# EAGLE design EEG board (EAGLE 7.5.0)
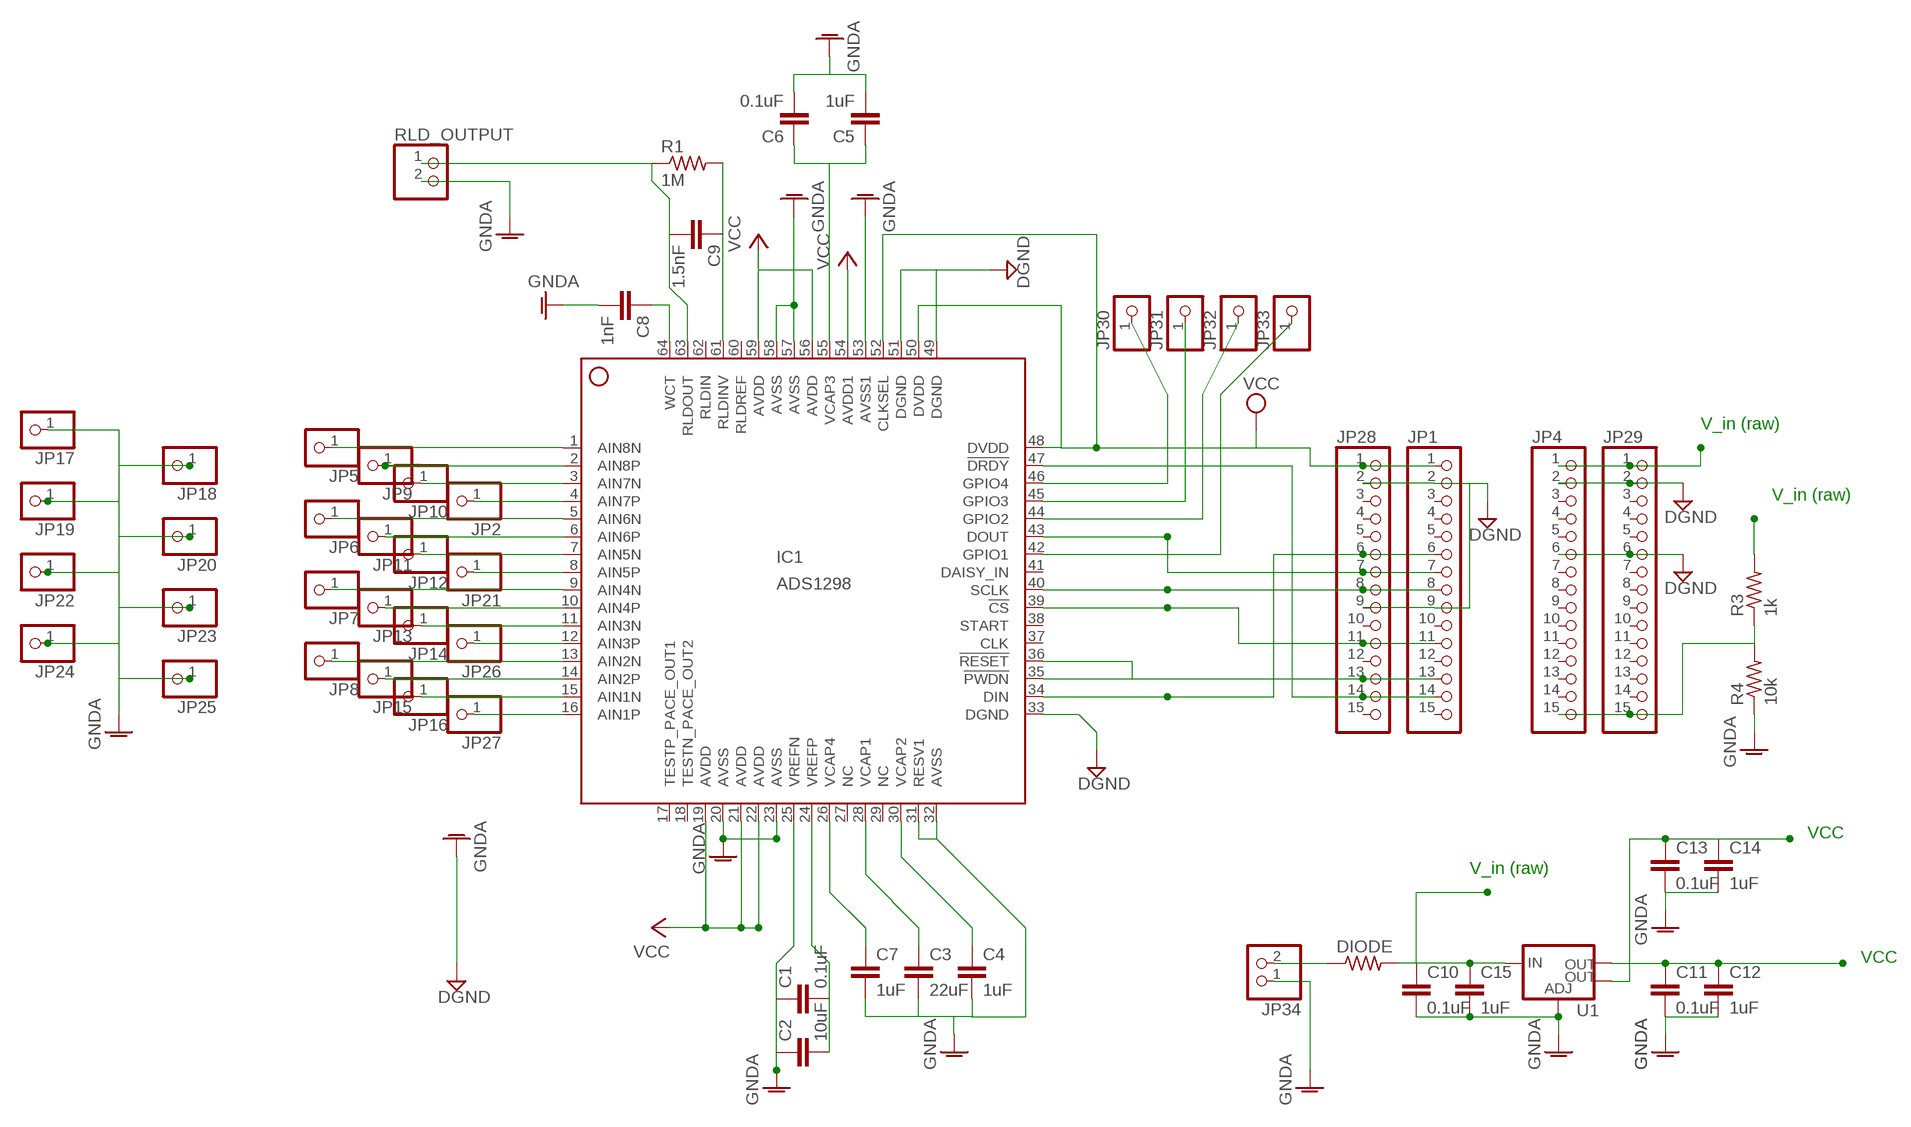
[diagram p0: schematic, sheet 1]

## Parts
C1  0.1uF  C-EUC0805  [C0805]
C2  10uF  C-EUC0805  [C0805]
C3  22uF  C-EUC0805  [C0805]
C4  1uF  C-EUC0805  [C0805]
C5  1uF  C-EUC0805  [C0805]
C6  0.1uF  C-EUC0805  [C0805]
C7  1uF  C-EUC0805  [C0805]
C8  1nF  C-EUC0805  [C0805]
C9  1.5nF  C-EUC0805  [C0805]
C10  0.1uF  C-EUC0805  [C0805]
C11  0.1uF  C-EUC0805  [C0805]
C12  1uF  C-EUC0805  [C0805]
C13  0.1uF  C-EUC0805  [C0805]
C14  1uF  C-EUC0805  [C0805]
C15  1uF  C-EUC0805  [C0805]
DIODE  R-US_R0805  [R0805]
IC1  ADS1298  [HTQFP-64-PAP]
JP1  PINHD-1X15  [1X15]
JP2  PINHD-1X1  [1X01]
JP4  PINHD-1X15  [1X15]
JP5  PINHD-1X1  [1X01]
JP6  PINHD-1X1  [1X01]
JP7  PINHD-1X1  [1X01]
JP8  PINHD-1X1  [1X01]
JP9  PINHD-1X1  [1X01]
JP10  PINHD-1X1  [1X01]
JP11  PINHD-1X1  [1X01]
JP12  PINHD-1X1  [1X01]
JP13  PINHD-1X1  [1X01]
JP14  PINHD-1X1  [1X01]
JP15  PINHD-1X1  [1X01]
JP16  PINHD-1X1  [1X01]
JP17  PINHD-1X1  [1X01]
JP18  PINHD-1X1  [1X01]
JP19  PINHD-1X1  [1X01]
JP20  PINHD-1X1  [1X01]
JP21  PINHD-1X1  [1X01]
JP22  PINHD-1X1  [1X01]
JP23  PINHD-1X1  [1X01]
JP24  PINHD-1X1  [1X01]
JP25  PINHD-1X1  [1X01]
JP26  PINHD-1X1  [1X01]
JP27  PINHD-1X1  [1X01]
JP28  PINHD-1X15  [1X15]
JP29  PINHD-1X15  [1X15]
JP30  PINHD-1X1  [1X01]
JP31  PINHD-1X1  [1X01]
JP32  PINHD-1X1  [1X01]
JP33  PINHD-1X1  [1X01]
JP34  PINHD-1X2  [1X02]
R1  1M  R-US_R0805  [R0805]
R3  1k  R-US_R0805  [R0805]
R4  10k  R-US_R0805  [R0805]
RLD_OUTPUT  PINHD-1X2/90  [1X02/90]
U1  V_REG_LM1117SOT223  [SOT223]

## Nets
9V: DIODE.1 JP34.2
AVDD: C11.1 C12.1 IC1.54(AVDD1) U1.2(OUT) ; supply symbol labelled VCC
AVDD1: C13.1 C14.1 IC1.19(AVDD) IC1.21(AVDD) IC1.22(AVDD) IC1.56(AVDD) IC1.59(AVDD) U1.4(OUT) ; supply symbol labelled VCC
AVSS: C1.1 C2.1 C3.2 C4.2 C5.2 C6.2 C7.2 C8.2 C10.2 C11.2 C12.2 C13.2 C14.2 C15.2 IC1.20(AVSS) IC1.23(AVSS) IC1.25(VREFN) IC1.31(RESV1) IC1.32(AVSS) IC1.53(AVSS1) IC1.57(AVSS) IC1.58(AVSS) JP4.2 JP17.1 JP18.1 JP19.1 JP20.1 JP22.1 JP23.1 JP24.1 JP25.1 JP29.2 JP34.1 R4.1 RLD_OUTPUT.2 U1.1(ADJ) ; supply symbol labelled GNDA, DGND
CS: IC1.39(!CS) JP1.11 JP28.11
DGND: IC1.33(DGND) IC1.49(DGND) IC1.51(DGND) JP1.2 JP1.9 JP4.6 JP28.2 JP28.9 JP29.6
DIN: IC1.34(DIN) JP1.6 JP28.6
DOUT: IC1.43(DOUT) JP1.7 JP28.7
DRDY: IC1.47(!DRDY) JP1.14 JP28.14
DVDD: IC1.48(DVDD) IC1.50(DVDD) IC1.52(CLKSEL) JP1.1 JP28.1 ; supply symbol labelled VCC
N$1: IC1.1(AIN8N) JP5.1
N$2: IC1.2(AIN8P) JP9.1
N$3: IC1.3(AIN7N) JP10.1
N$4: IC1.4(AIN7P) JP2.1
N$5: IC1.5(AIN6N) JP6.1
N$6: IC1.6(AIN6P) JP11.1
N$7: IC1.7(AIN5N) JP12.1
N$8: IC1.8(AIN5P) JP21.1
N$9: IC1.9(AIN4N) JP7.1
N$10: IC1.10(AIN4P) JP13.1
N$11: IC1.11(AIN3N) JP14.1
N$12: IC1.12(AIN3P) JP26.1
N$13: IC1.13(AIN2N) JP8.1
N$14: IC1.14(AIN2P) JP15.1
N$15: IC1.15(AIN1N) JP16.1
N$16: IC1.16(AIN1P) JP27.1
N$18: C1.2 C2.2 IC1.24(VREFP)
N$19: C3.1 IC1.28(VCAP1)
N$20: C4.1 IC1.30(VCAP2)
N$21: C5.1 C6.1 IC1.55(VCAP3)
N$22: C8.1 IC1.64(WCT)
N$23: C7.1 IC1.26(VCAP4)
N$24: C9.1 IC1.61(RLDINV) R1.2
N$25: JP4.15 JP29.15 R3.1 R4.2
N$26: C9.2 IC1.63(RLDOUT) R1.1 RLD_OUTPUT.1
N$27: IC1.45(GPIO3) JP31.1
N$28: IC1.44(GPIO2) JP32.1
N$29: IC1.42(GPIO1) JP33.1
N$30: IC1.46(GPIO4) JP30.1
PDWN/RESET: IC1.35(!PWDN) IC1.36(!RESET) JP1.13 JP28.13
SCLK: IC1.40(SCLK) JP1.8 JP28.8
VIN: C10.1 C15.1 DIODE.2 JP4.1 JP29.1 R3.2 U1.3(IN)
Unconnected: IC1.17(TESTP_PACE_OUT1) IC1.18(TESTN_PACE_OUT2) IC1.27(NC) IC1.29(NC) IC1.37(CLK) IC1.38(START) IC1.41(DAISY_IN) IC1.60(RLDREF) IC1.62(RLDIN) JP1.3 JP1.4 JP1.5 JP1.10 JP1.12 JP1.15 JP4.3 JP4.4 JP4.5 JP4.7 JP4.8 JP4.9 JP4.10 JP4.11 JP4.12 JP4.13 JP4.14 JP28.3 JP28.4 JP28.5 JP28.10 JP28.12 JP28.15 JP29.3 JP29.4 JP29.5 JP29.7 JP29.8 JP29.9 JP29.10 JP29.11 JP29.12 JP29.13 JP29.14

## Notes on the sheet
- V_in (raw)
- V_in (raw)
- VCC
- V_in (raw)
- VCC

## Library data of the parts
C1-C15 = rcl - matt:C-EU: CAPACITOR, European symbol
DIODE R1 R3 R4 = rcl - matt:R-US_: RESISTOR, American symbol
IC1 = ADS1298:ADS1298: Quad/Octal, Simultaneous Sampling, 24-Bit Analog-to-Digital Converters ADS1294 / ADS1298 Source: http://focus.ti.com/lit/ds/symlink/ads1294.pdf; AVAILABILITY: Unavailable; DESCRIPTION: 8-Channel 24-Bit Analog-To-Digital Converter With Integrated ECG Front End; MF: Texas Instruments; MP: ADS1298; PACKAGE: None; PRICE: None
JP1 JP4 JP28 JP29 = pinhead:PINHD-1X15: PIN HEADER
JP2 JP5-JP27 JP30-JP33 = pinhead:PINHD-1X1: PIN HEADER
JP34 RLD_OUTPUT = pinhead:PINHD-1X2: PIN HEADER
U1 = SparkFun-IC-Power:V_REG_LM1117: Voltage Regulator LM1117 Standard adjustable voltage regulator but in SMD form. Spark Fun Electronics SKU : COM-00595; PROD_ID: VREG-08170

## Board
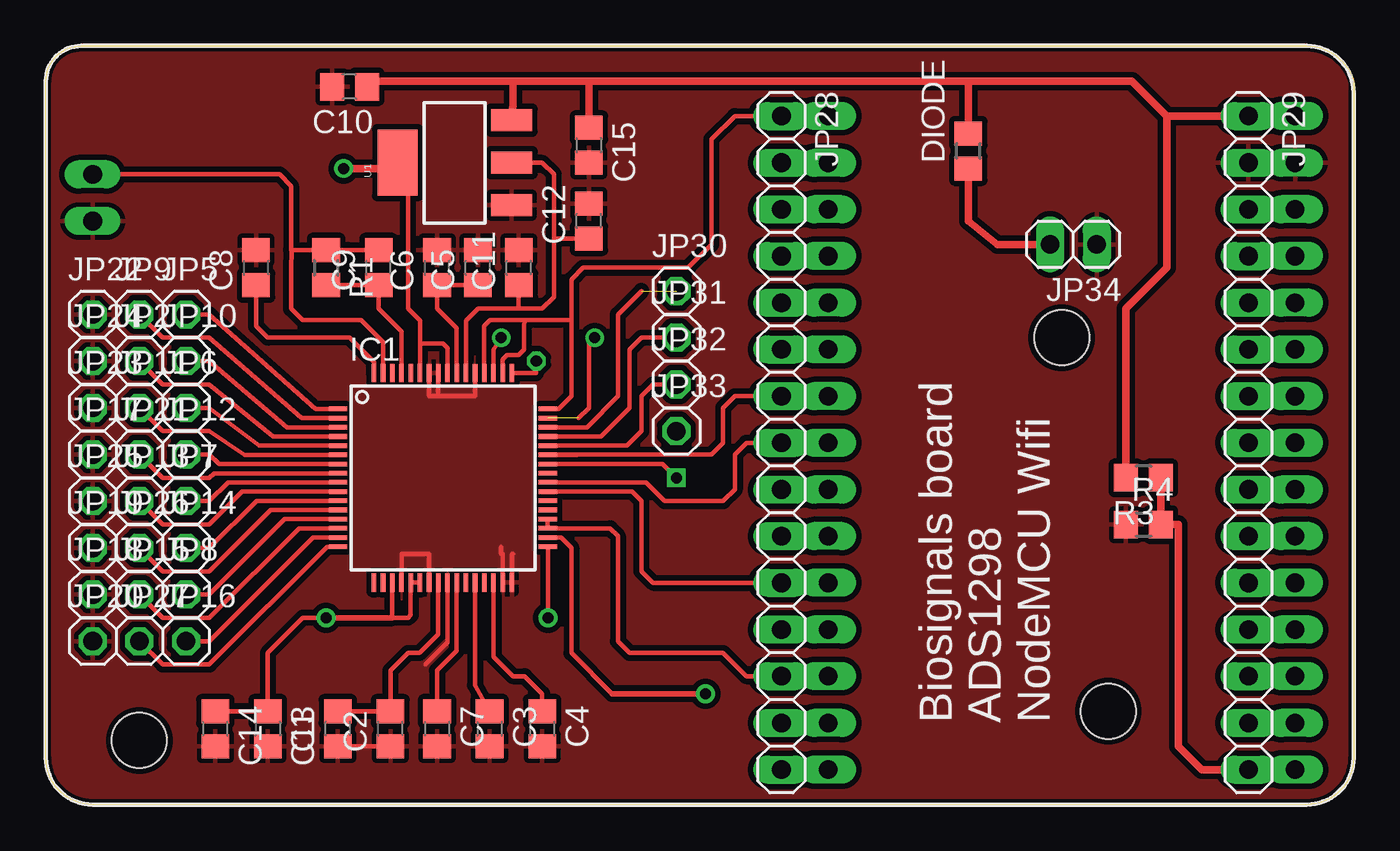
[diagram p1: board, top side]
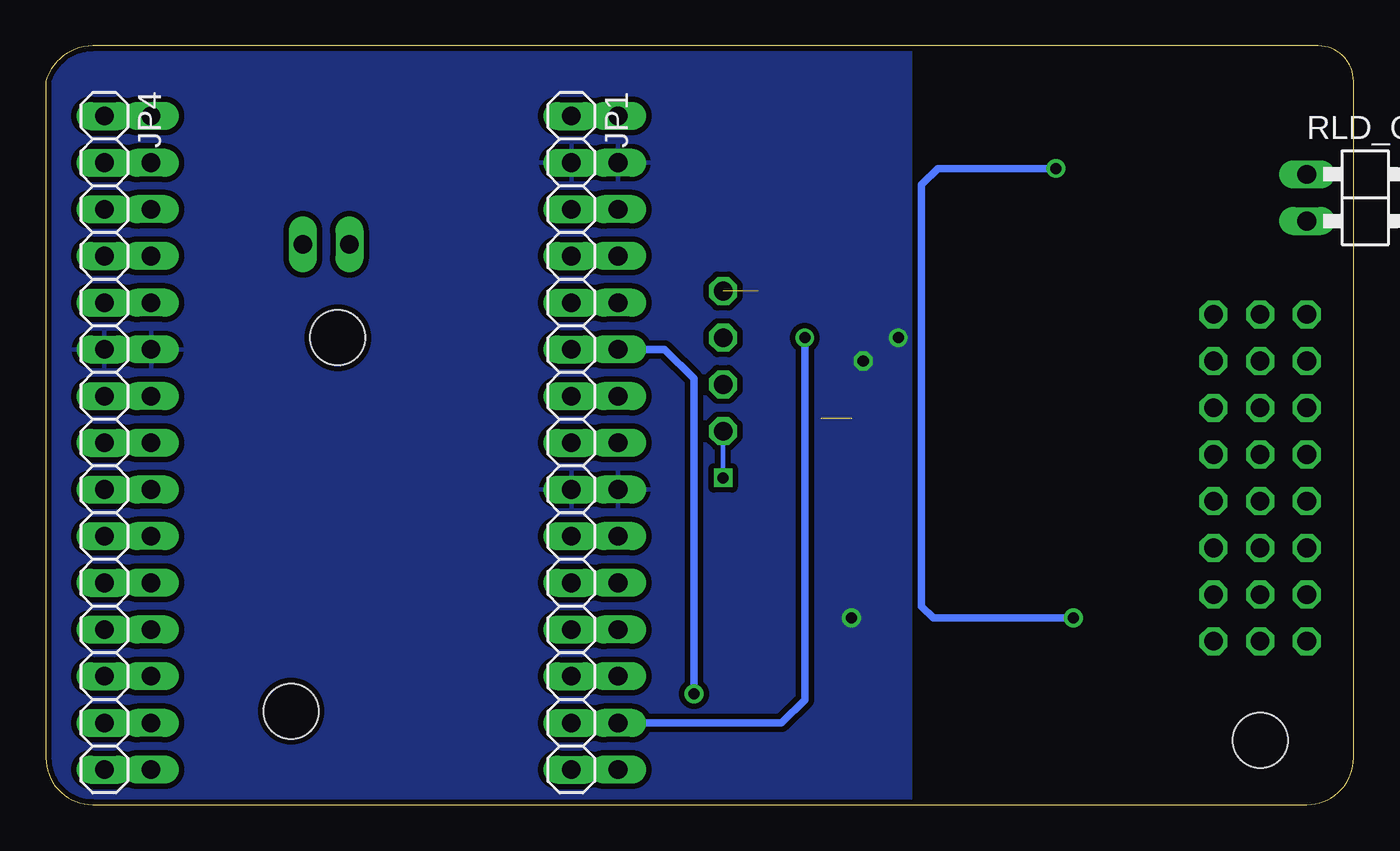
[diagram p2: board, bottom side, seen from below]

Size 71.12 x 41.27 mm. Coordinates in mm from the lower left corner, seen from the top.
Outline: 1.91,41.27 68.58,41.27 arc-74 71.12,39.37 71.12,2.54 arc-90 68.58,0 2.54,0 arc-90 0,2.54 0,39.37 arc-90 1.91,41.27
Copper layers (1*16): Top 0.035mm / dielectric 1.5mm / Bottom 0.035mm
Design rules "default *": minimum track width 8mil, minimum drill 0.3mm, track to track 8mil, track to pad 8mil, pad to pad 8mil, via to via 8mil, smd to smd 8mil, copper to edge 12mil, drill to drill 10mil, minimum pad ring 10mil, minimum via ring 8mil, stop-mask expansion 4mil, vias tented up to drill 30mil, thermal gap 10mil
Holes 3 mm at 5.08,3.49 57.78,5.08 55.24,25.4

### Footprints (pad centres in the part's own frame; a part is rotated, then mirrored left to right if it is on the bottom)
C0805 = smd 1.3 x 1.5: 1 -0.95,0; 2 0.95,0
R0805 = smd 1.3 x 1.5: 1 -0.95,0; 2 0.95,0
HTQFP-64-PAP = smd 1 x 0.25: 1 -5.7,3.75; 2 -5.7,3.25; 3 -5.7,2.75; 4 -5.7,2.25; 5 -5.7,1.75; 6 -5.7,1.25; 7 -5.7,0.75; 8 -5.7,0.25; 9 -5.7,-0.25; 10 -5.7,-0.75; 11 -5.7,-1.25; 12 -5.7,-1.75; 13 -5.7,-2.25; 14 -5.7,-2.75; 15 -5.7,-3.25; 16 -5.7,-3.75; 33 5.7,-3.75; 34 5.7,-3.25; 35 5.7,-2.75; 36 5.7,-2.25; 37 5.7,-1.75; 38 5.7,-1.25; 39 5.7,-0.75; 40 5.7,-0.25; 41 5.7,0.25; 42 5.7,0.75; 43 5.7,1.25; 44 5.7,1.75; 45 5.7,2.25; 46 5.7,2.75; 47 5.7,3.25; 48 5.7,3.75 | smd 0.25 x 1: 17 -3.75,-5.7; 18 -3.25,-5.7; 19 -2.75,-5.7; 20 -2.25,-5.7; 21 -1.75,-5.7; 22 -1.25,-5.7; 23 -0.75,-5.7; 24 -0.25,-5.7; 25 0.25,-5.7; 26 0.75,-5.7; 27 1.25,-5.7; 28 1.75,-5.7; 29 2.25,-5.7; 30 2.75,-5.7; 31 3.25,-5.7; 32 3.75,-5.7; 49 3.75,5.7; 50 3.25,5.7; 51 2.75,5.7; 52 2.25,5.7; 53 1.75,5.7; 54 1.25,5.7; 55 0.75,5.7; 56 0.25,5.7; 57 -0.25,5.7; 58 -0.75,5.7; 59 -1.25,5.7; 60 -1.75,5.7; 61 -2.25,5.7; 62 -2.75,5.7; 63 -3.25,5.7; 64 -3.75,5.7
1X15 = drill 1.016 long: 1 -17.78,0; 2 -15.24,0; 3 -12.7,0; 4 -10.16,0; 5 -7.62,0; 6 -5.08,0; 7 -2.54,0; 8 0,0; 9 2.54,0; 10 5.08,0; 11 7.62,0; 12 10.16,0; 13 12.7,0; 14 15.24,0; 15 17.78,0
1X01 = drill 1.016 octagon: 1 0,0
1X02 = drill 1.016 long: 1 -1.27,0; 2 1.27,0
1X02/90 = drill 1.016 long: 1 -1.27,-3.81; 2 1.27,-3.81
SOT223 = smd 1.219 x 2.235: 1 -2.311,-3.099; 2 0,-3.099; 3 2.311,-3.099 | smd 3.6 x 2.2: 4 0,3.099

### Placement (x,y rotation side)
C1  15.88,4.13 90 top
C2  18.73,4.13 90 top
C3  24.13,4.13 270 top
C4  26.99,4.13 270 top
C5  23.5,29.21 90 top
C6  21.27,29.21 90 top
C7  21.27,4.13 270 top
C8  11.43,29.21 90 top
C9  18.1,29.21 90 top
C10  16.51,39.05 180 top
C11  25.72,29.21 90 top
C12  29.53,31.75 90 top
C13  12.06,4.13 270 top
C14  9.21,4.13 270 top
C15  29.53,35.88 270 top
DIODE  50.16,35.56 90 top
IC1  21.59,17.78 0 top
JP1  42.55,19.68 270 bottom
JP2  5.08,24.13 0 top
JP4  67.94,19.68 270 bottom
JP5  7.62,26.67 0 top
JP6  7.62,21.59 0 top
JP7  7.62,16.51 0 top
JP8  7.62,11.43 0 top
JP9  5.08,26.67 0 top
JP10  7.62,24.13 0 top
JP11  5.08,21.59 0 top
JP12  7.62,19.05 0 top
JP13  5.08,16.51 0 top
JP14  7.62,13.97 0 top
JP15  5.08,11.43 0 top
JP16  7.62,8.89 0 top
JP17  2.54,19.05 0 top
JP18  2.54,11.43 0 top
JP19  2.54,13.97 0 top
JP20  2.54,8.89 0 top
JP21  5.08,19.05 0 top
JP22  2.54,26.67 0 top
JP23  2.54,21.59 0 top
JP24  2.54,24.13 0 top
JP25  2.54,16.51 0 top
JP26  5.08,13.97 0 top
JP27  5.08,8.89 0 top
JP28  40.01,19.68 270 top
JP29  65.41,19.68 270 top
JP30  34.29,27.94 0 top
JP31  34.29,25.4 0 top
JP32  34.29,22.86 0 top
JP33  34.29,20.32 0 top
JP34  55.88,30.48 180 top
R1  15.24,29.21 270 top
R3  59.69,17.78 180 top
R4  59.69,15.24 0 top
RLD_OUTPUT  -1.27,33.02 270 bottom
U1  22.23,34.92 90 top

### Tracks (layer width: path | path; a pad name or v marks a point on that pad's centre or on a via)
9V
  Top 0.406: DIODE.1 50.16,31.75 51.76,30.48 JP34.2
AVDD
  Top 0.254: IC1.54 22.84,26.33 23.5,26.99 25.72,26.99 | 25.72,26.99 26.99,26.99 27.62,27.62 27.62,30.8 | 27.62,30.8 27.62,34.29 26.99,34.92 U1.2 | C11.1 25.72,26.99 | C12.1 27.62,30.8
AVDD1  (via drill 0.6 pad 1.02)
  Top 0.254: IC1.19 18.84,10.16 19.68,10.16 19.84,10.31 IC1.21 IC1.22 | 19.37,34.61 19.37,33.9 19.13,33.66 U1.4 20,34.05 20,33.97 19.68,33.66 19.68,26.99 20.34,26.33 20.34,25.08 | v15.24,10.16 13.97,10.16 12.06,8.26 C13.1 C14.1 | IC1.56 21.84,24.83 21.59,25.08 20.34,25.08 | IC1.59 20.34,25.08
  Top 0.305: v15.24,10.16 18.84,10.16
  Top 0.406: v16.19,34.61 19.37,34.61
  Bottom 0.254: 16.23,34.65 v16.19,34.61
  Bottom 0.406: v15.24,10.16 22.86,10.16 23.5,10.79 23.5,33.73 22.62,34.61 v16.19,34.61
AVSS
  Top 0.254: 21.34,22.86 IC1.57 21.34,22.23 | IC1.32 25.34,13.65 25.4,13.65 | IC1.31 24.84,13.65 24.77,13.65 24.77,14.03 | IC1.58 20.84,22.23 21.34,22.23 | IC1.53 23.34,22.23 21.34,22.23 | IC1.23 20.84,13.65 19.34,13.65 IC1.20 | C2.1 C1.1 | IC1.25 21.84,8.82 20.64,7.62
  pour Top (isolate 0.305): 68.58,41.27 1.91,41.27 arc90 0,39.37 0,2.54 arc90 2.54,0 68.58,0 arc90 71.12,2.54 71.12,39.37 arc74
CS
  Top 0.254: IC1.39 31.86,17.03 32.38,16.51 32.38,12.7 33.02,12.06 JP28.11 | 41.91,12.06 JP1.11
  Top 0.406: JP28.11 41.91,12.06
DGND  (via drill 0.6 pad 1.02)
  Top 0.254: IC1.33 arc-90 27.3,14.02 v27.3,10.16 | IC1.51 24.34,24.77 v24.77,25.4 | IC1.49 26.66,23.48 v26.67,24.13
  pour Bottom (isolate 0.305): 68.58,0 24.13,0 24.13,41.27 68.58,41.27 arc-74 71.12,39.37 71.12,2.54 arc-90
DIN  (via drill 0.6 pad 1.02)
  Top 0.254: IC1.34 28.02,14.53 28.57,13.97 28.57,8.26 30.8,6.03
  Top 0.305: v35.88,6.03 30.8,6.03
  Bottom 0.406: v35.88,6.03 35.88,23.18 37.47,24.77 JP28.6 JP1.6
DOUT
  Top 0.254: 36.2,19.05 36.83,19.68 36.83,21.59 37.47,22.23 JP28.7 | 36.2,19.05 28.87,19.03 IC1.43 | IC1.43 | IC1.43 27.29,19.05 36.2,19.05 | 41.91,22.23 JP1.7
  Top 0.406: JP28.7 41.91,22.23
DRDY  (via drill 0.6)  (1 unrouted)
  Top 0.254: 28.97,21.03 29.53,21.59 29.53,25.08 v29.84,25.4
  Bottom 0.406: v29.84,25.4 29.84,5.71 31.11,4.45 JP28.14 JP1.14
DVDD
  Top 0.254: IC1.48 27.88,21.53 28.57,22.23 28.57,26.35 | 28.57,26.35 28.57,28.57 29.21,29.21 34.92,29.21 36.2,30.48 36.2,36.2 37.47,37.47 JP28.1 | IC1.50 24.84,24.2 25.08,24.45 25.7,24.45 26.02,24.77 26.02,26.02 26.04,26.35 | 28.57,26.35 26.04,26.35 | IC1.52 23.84,26.04 24.16,26.35 26.04,26.35
  Top 0.406: JP28.1 JP1.1
N$1
  Top 0.254: IC1.1 14.66,21.53 8.89,26.67 JP5.1
N$2
  Top 0.254: IC1.2 13.89,21.03 8.89,25.4 6.35,25.4 JP9.1
N$3
  Top 0.254: IC1.3 13.12,20.53 8.89,24.13 JP10.1
N$4
  Top 0.254: IC1.4 12.36,20.03 8.89,22.86 6.35,22.86 JP2.1
N$5
  Top 0.254: IC1.5 11.59,19.53 8.89,21.59 JP6.1
N$6
  Top 0.254: IC1.6 10.81,19.03 8.89,20.32 6.35,20.32 JP11.1
N$7
  Top 0.254: IC1.7 9.41,18.53 8.89,19.05 JP12.1
N$8
  Top 0.254: IC1.8 9.14,18.03 8.89,17.78 6.35,17.78 JP21.1
N$9
  Top 0.254: IC1.9 9.91,17.53 8.89,16.51 JP7.1
N$10
  Top 0.254: IC1.10 10.68,17.03 8.89,15.24 6.35,15.24 JP13.1
N$11
  Top 0.254: IC1.11 11.45,16.53 8.89,13.97 JP14.1
N$12
  Top 0.254: IC1.12 12.22,16.03 8.89,12.7 6.35,12.7 JP26.1
N$13
  Top 0.254: IC1.13 12.99,15.53 8.89,11.43 JP8.1
N$14
  Top 0.254: IC1.14 13.76,15.03 8.89,10.16 6.35,10.16 JP15.1
N$15
  Top 0.254: IC1.15 14.53,14.53 8.89,8.89 | 8.88,8.9 8.89,8.89 | JP16.1 8.89,8.89
N$16
  Top 0.254: IC1.16 15.3,14.03 8.89,7.62 6.35,7.62 JP27.1
N$18
  Top 0.254: C1.2 C2.2 18.73,7.3 19.68,8.26 20.32,8.26 21.34,9.28 IC1.24
N$19
  Top 0.254: IC1.28 23.34,6.5 C3.1
N$20
  Top 0.254: IC1.30 24.34,8.04 25.4,6.99 26.04,6.99 26.99,6.03 C4.1
N$21
  Top 0.254: 23.18,27.94 C5.1 C6.1 21.27,26.99 22.34,25.92 IC1.55
N$22
  Top 0.254: IC1.64 17.84,24.07 16.51,25.4 12.06,25.4 11.43,26.04 C8.1
N$23
  Top 0.254: IC1.26 22.34,8.37 21.27,7.3 C7.1
N$24
  Top 0.254: R1.2 C9.1 18.1,26.99 19.34,25.75 IC1.61
N$25
  Top 0.406: R3.1 R4.2 61.59,15.24 61.59,3.17 62.87,1.91 JP29.15 JP4.15
N$26
  Top 0.254: RLD_OUTPUT.1 12.7,34.29 13.34,33.66 13.34,30.18 13.35,30.16 | IC1.63 18.34,25.16 17.14,26.35 13.97,26.35 13.34,26.99 13.34,29.11 13.35,30.16 | 13.35,30.16 16.51,30.16 R1.1 C9.2
N$27
  Top 0.254: IC1.45 30.19,20.03 31.75,21.59 31.75,24.77 32.38,25.4 JP31.1
N$28
  Top 0.254: IC1.44 31.59,19.53 32.38,20.32 32.38,22.23 33.02,22.86 JP32.1
N$29  (via drill 0.6)
  Top 0.254: IC1.42 33.54,18.53 v34.29,17.78
  Bottom 0.254: v34.29,17.78 JP33.1
N$30  (1 unrouted)
  Top 0.254: IC1.46 29.42,20.53 31.11,22.23 31.11,26.67 32.38,27.94
PDWN/RESET
  Top 0.254: IC1.36 IC1.35 30.69,15.03 31.11,14.61 31.11,8.89 31.75,8.26 36.83,8.26 38.1,6.99 JP28.13 | 40.64,6.99 JP1.13
  Top 0.406: JP28.13 40.64,6.99
SCLK
  Top 0.254: IC1.40 32.63,17.53 33.66,16.51 36.83,16.51 37.47,17.14 37.47,19.05 38.1,19.68 JP28.8
  Top 0.406: JP1.8 JP28.8
VIN
  Top 0.406: 50.16,39.37 59.05,39.37 60.96,37.47 | 50.16,39.37 29.53,39.37 | 29.53,39.37 25.4,39.37 | U1.3 25.4,38.1 25.4,39.37 | C15.1 29.53,39.37 | 60.96,37.47 60.96,29.21 58.74,26.99 R3.2 | 60.96,37.47 JP29.1 JP4.1 | DIODE.2 50.16,39.37 | 25.4,39.37 17.7,39.37 17.46,39.37 C10.1

### Text on the board
tPlace: Biosignals board / ADS1298 / NodeMCU Wifi